# EAGLE design isense_rev1 (EAGLE 7.3.0)
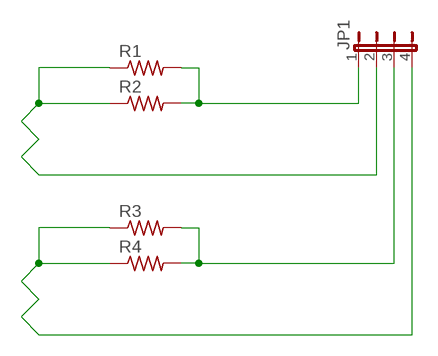
[diagram p0: schematic, sheet 1]

## Parts
JP1  JP4E  [JP4]
R1  R-US_R0603  [R0603]
R2  R-US_R0603  [R0603]
R3  R-US_R0603  [R0603]
R4  R-US_R0603  [R0603]

## Nets
COIL: JP1.2 R1.1 R2.1
COIL1: JP1.4 R3.1 R4.1
N$1: JP1.3 R3.2 R4.2
N$2: JP1.1 R1.2 R2.2

## Library data of the parts
JP1 = jumper:JP4E: JUMPER
R1-R4 = rcl:R-US_: RESISTOR, American symbol

## Board
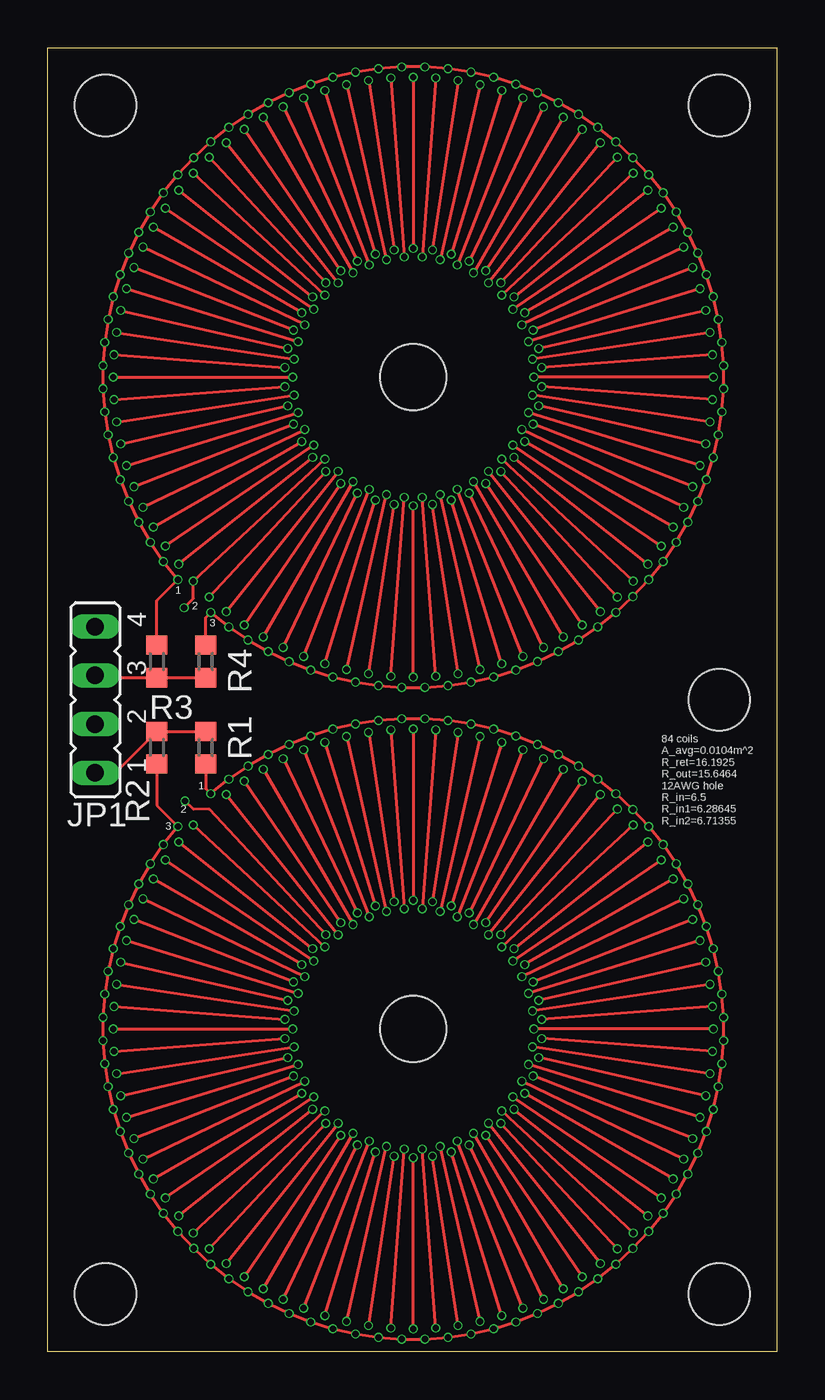
[diagram p1: board, top side]
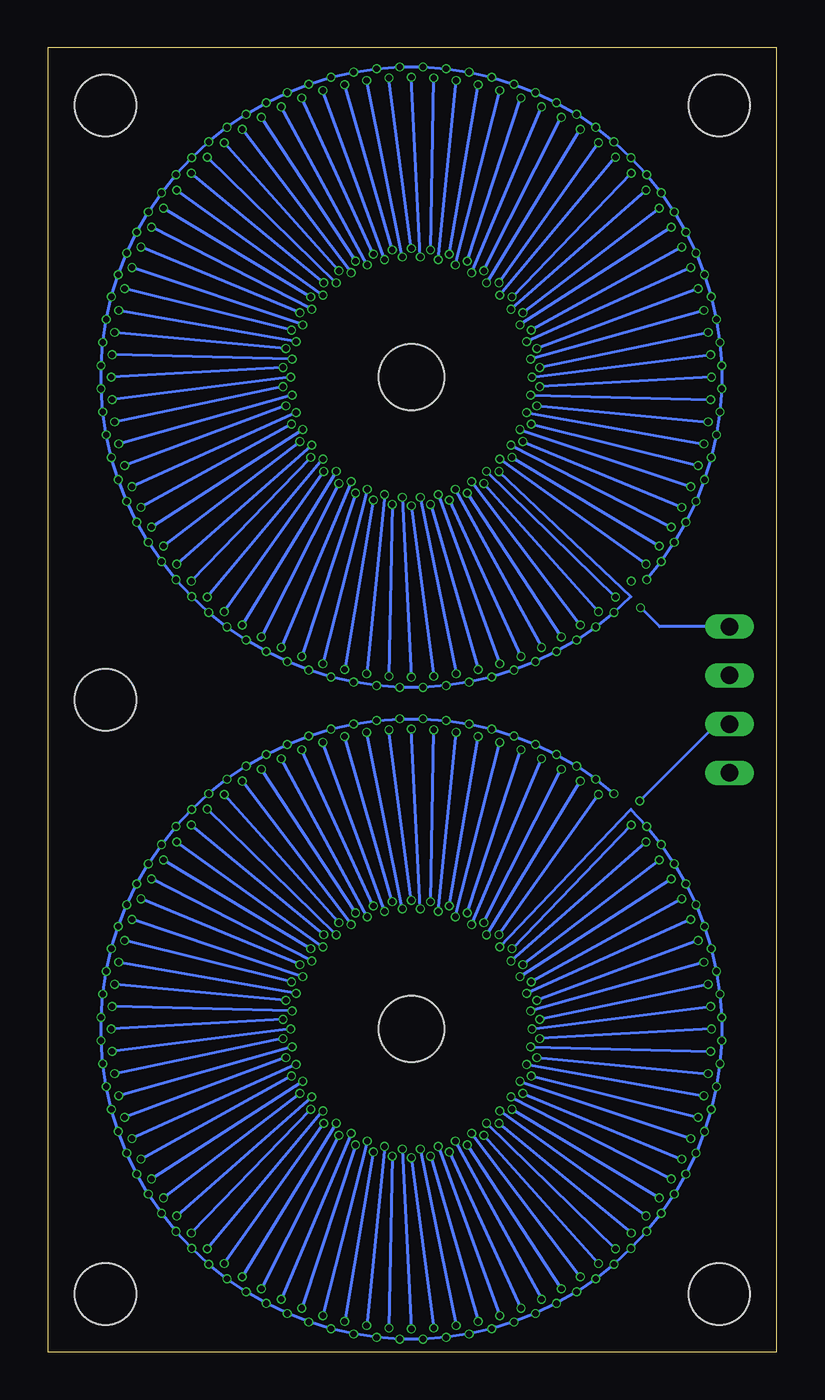
[diagram p2: board, bottom side, seen from below]

Size 38 x 68 mm. Coordinates in mm from the lower left corner, seen from the top.
Outline: 0,0 0,68 38,68 38,0 0,0
Copper layers (1*16): Top 0.035mm / dielectric 1.5mm / Bottom 0.035mm
Design rules "default *": minimum track width 6mil, minimum drill 0.33mm, track to track 6mil, track to pad 6mil, pad to pad 6mil, via to via 6mil, smd to smd 6mil, copper to edge 25mil, drill to drill 8mil, minimum pad ring 0mil, minimum via ring 0mil, stop-mask expansion 4mil, vias tented up to drill 20mil, thermal gap 10mil
Holes 3.43 mm at 19.05,16.83 19.05,50.83
Holes 3.2 mm at 3,3 35,34 3,65 35,65 35,3

### Footprints (pad centres in the part's own frame; a part is rotated, then mirrored left to right if it is on the bottom)
JP4 = drill 0.914 long: 1 -3.81,0; 2 -1.27,0; 3 1.27,0; 4 3.81,0
R0603 = smd 1 x 1.1: 1 -0.85,0; 2 0.85,0

### Placement (x,y rotation side)
JP1  2.46,34 90 top
R1  8.22,31.5 90 top
R2  5.68,31.5 90 top
R3  5.68,36 270 top
R4  8.22,36 270 top

### Tracks (layer width: path | path; a pad name or v marks a point on that pad's centre or on a via)
COIL  (via drill 0.33)
  Top 0.152: v14.48,21.75 8.41,28.3 7.6,28.28 v7.14,28.72 | v9.29,29.06 v15.13,21.74 | v10.24,29.75 v15.27,22.37 | v11.23,30.38 v15.91,22.27 | v12.26,30.92 v16.14,22.88 | v13.33,31.39 v16.75,22.68 | v14.44,31.78 v17.07,23.24 | v15.57,32.08 v17.65,22.96 | v16.72,32.3 v18.05,23.47 | v17.88,32.43 v18.58,23.1 | v7.58,27.47 v14.44,21.1 | v13.8,21.01 v6.82,26.58 | v13.86,20.37 v6.12,25.64 | v13.24,20.18 v5.5,24.65 | v13.39,19.55 v4.95,23.62 | v12.8,19.28 v4.49,22.54 | v4.1,21.44 v13.04,18.68 | v3.8,20.31 v12.51,18.32 | v3.58,19.16 v12.83,17.76 | v3.45,18 v12.36,17.33 | v3.4,16.83 v12.76,16.83 | v3.45,15.66 v12.36,16.33 | v19.05,32.47 v19.05,23.54 | v20.22,32.43 v19.52,23.1 | v21.38,32.3 v20.05,23.47 | v22.53,32.08 v20.45,22.96 | v23.66,31.78 v21.03,23.24 | v24.77,31.39 v21.35,22.68 | v25.84,30.92 v21.96,22.88 | v26.87,30.38 v22.19,22.27 | v27.86,29.75 v22.83,22.37 | v28.8,29.06 v22.97,21.74 | v29.69,28.3 v23.62,21.75 | v30.52,27.47 v23.66,21.1 | v31.28,26.58 v24.3,21.01 | v31.98,25.64 v24.24,20.37 | v32.6,24.65 v24.86,20.18 | v33.15,23.62 v24.71,19.55 | v33.62,22.54 v25.3,19.28 | v34,21.44 v25.06,18.68 | v34.3,20.31 v25.59,18.32 | v34.52,19.16 v25.27,17.76 | v34.65,18 v25.75,17.33 | v34.7,16.83 v25.34,16.83 | v34.65,15.66 v25.75,16.33 | v34.52,14.5 v25.27,15.89 | v34.3,13.35 v25.59,15.33 | v34,12.22 v25.06,14.97 | v33.62,11.11 v25.3,14.38 | v33.15,10.04 v24.71,14.1 | v32.6,9 v24.86,13.47 | v31.98,8.01 v24.24,13.29 | v31.28,7.07 v24.3,12.64 | v30.52,6.18 v23.66,12.55 | v29.69,5.36 v23.62,11.91 | v28.8,4.59 v22.97,11.91 | v27.86,3.9 v22.83,11.28 | v26.87,3.28 v22.19,11.38 | v25.84,2.73 v21.96,10.78 | v24.77,2.26 v21.35,10.98 | v23.66,1.88 v21.03,10.41 | v22.53,1.57 v20.45,10.7
  Top 0.152: v21.38,1.36 v20.05,10.19 | v20.22,1.23 v19.52,10.56 | v19.05,1.18 v19.05,10.11 | v17.88,1.23 v18.58,10.56 | v16.72,1.36 v18.05,10.19 | v15.57,1.57 v17.65,10.7 | v14.44,1.88 v17.07,10.41 | v13.33,2.26 v16.75,10.98 | v12.26,2.73 v16.14,10.78 | v11.23,3.28 v15.91,11.38 | v10.24,3.9 v15.27,11.28 | v9.29,4.59 v15.13,11.91 | v8.41,5.36 v14.48,11.91 | v7.58,6.18 v14.44,12.55 | v6.82,7.07 v13.8,12.64 | v6.12,8.01 v13.86,13.29 | v5.5,9 v13.24,13.47 | v4.95,10.04 v13.39,14.1 | v4.49,11.11 v12.8,14.38 | v4.1,12.22 v13.04,14.97 | v3.8,13.35 v12.51,15.33 | v3.58,14.5 v12.83,15.89 | R2.1 5.68,28.49 v6.78,27.39 v6.02,26.44 v5.34,25.44 v4.73,24.39 v4.21,23.3 v3.77,22.18 v3.41,21.02 v3.14,19.84 v2.96,18.64 v2.87,17.43 v2.87,16.22 v2.96,15.02 v3.14,13.82 v3.41,12.64 v3.77,11.48 v4.21,10.35 v4.73,9.26 v5.34,8.21 v6.02,7.21 v6.78,6.26 v7.6,5.38 v8.49,4.55 v9.44,3.8 v10.44,3.12 v11.48,2.51 v12.57,1.99 v13.7,1.54 v14.86,1.19 v16.04,0.92 v17.24,0.74 v18.45,0.65 v19.66,0.65 v20.86,0.74 v22.06,0.92 v23.24,1.19 v24.4,1.54 v25.52,1.99 v26.62,2.51 v27.66,3.12 v28.66,3.8 v29.61,4.55 v30.5,5.38 v31.32,6.26 v32.08,7.21 v32.76,8.21 v33.37,9.26 v33.89,10.35 v34.33,11.48 v34.69,12.64 v34.96,13.82 v35.14,15.02 v35.23,16.22 v35.23,17.43 v35.14,18.64 v34.96,19.84 v34.69,21.02 v34.33,22.18 v33.89,23.3 v33.37,24.39 v32.76,25.44 v32.08,26.44 v31.32,27.39 v30.5,28.28 v29.61,29.1 v28.66,29.86 v27.66,30.54 v26.62,31.14 v25.52,31.67 v24.4,32.11 v23.24,32.47 v22.06,32.74 v20.86,32.92 v19.66,33.01 v18.45,33.01 v17.24,32.92 v16.04,32.74 v14.86,32.47 v13.7,32.11 v12.57,31.67 v11.48,31.14 v10.44,30.54 v9.44,29.86 v8.49,29.1 8.22,29.37 R1.1
  Bottom 0.152: v14.48,21.75 v9.29,29.06 | v15.13,21.74 v10.24,29.75 | v15.27,22.37 v11.23,30.38 | v15.91,22.27 v12.26,30.92 | v16.14,22.88 v13.33,31.39 | v16.75,22.68 v14.44,31.78 | v17.07,23.24 v15.57,32.08 | v17.65,22.96 v16.72,32.3 | v18.05,23.47 v17.88,32.43 | v18.58,23.1 v19.05,32.47 | v14.44,21.1 7.6,28.28 v6.78,27.39 v6.02,26.44 v5.34,25.44 v4.73,24.39 v4.21,23.3 v3.77,22.18 v3.41,21.02 v3.14,19.84 v2.96,18.64 v2.87,17.43 v2.87,16.22 v2.96,15.02 v3.14,13.82 v3.41,12.64 v3.77,11.48 v4.21,10.35 v4.73,9.26 v5.34,8.21 v6.02,7.21 v6.78,6.26 v7.6,5.38 v8.49,4.55 v9.44,3.8 v10.44,3.12 v11.48,2.51 v12.57,1.99 v13.7,1.54 v14.86,1.19 v16.04,0.92 v17.24,0.74 v18.45,0.65 v19.66,0.65 v20.86,0.74 v22.06,0.92 v23.24,1.19 v24.4,1.54 v25.52,1.99 v26.62,2.51 v27.66,3.12 v28.66,3.8 v29.61,4.55 v30.5,5.38 v31.32,6.26 v32.08,7.21 v32.76,8.21 v33.37,9.26 v33.89,10.35 v34.33,11.48 v34.69,12.64 v34.96,13.82 v35.14,15.02 v35.23,16.22 v35.23,17.43 v35.14,18.64 v34.96,19.84 v34.69,21.02 v34.33,22.18 v33.89,23.3 v33.37,24.39 v32.76,25.44 v32.08,26.44 v31.32,27.39 v30.5,28.28 v29.61,29.1 v28.66,29.86 v27.66,30.54 v26.62,31.14 v25.52,31.67 v24.4,32.11 v23.24,32.47 v22.06,32.74 v20.86,32.92 v19.66,33.01 v18.45,33.01 v17.24,32.92 v16.04,32.74 v14.86,32.47 v13.7,32.11 v12.57,31.67 v11.48,31.14 v10.44,30.54 v9.44,29.86 v8.49,29.1 | v7.58,27.47 v13.8,21.01 | v6.82,26.58 v13.86,20.37 | v6.12,25.64 v13.24,20.18 | v5.5,24.65 v13.39,19.55 | v4.95,23.62 v12.8,19.28 | v4.49,22.54 v13.04,18.68 | v4.1,21.44 v12.51,18.32 | v3.8,20.31 v12.83,17.76 | v3.58,19.16 v12.36,17.33 | v12.76,16.83 v3.45,18
  Bottom 0.152: v3.4,16.83 v12.36,16.33 | v19.05,23.54 v20.22,32.43 | v19.52,23.1 v21.38,32.3 | v20.05,23.47 v22.53,32.08 | v20.45,22.96 v23.66,31.78 | v21.03,23.24 v24.77,31.39 | v21.35,22.68 v25.84,30.92 | v21.96,22.88 v26.87,30.38 | v22.19,22.27 v27.86,29.75 | v22.83,22.37 v28.8,29.06 | v22.97,21.74 v29.69,28.3 | v23.62,21.75 v30.52,27.47 | v23.66,21.1 v31.28,26.58 | v24.3,21.01 v31.98,25.64 | v24.24,20.37 v32.6,24.65 | v24.86,20.18 v33.15,23.62 | v24.71,19.55 v33.62,22.54 | v25.3,19.28 v34,21.44 | v25.06,18.68 v34.3,20.31 | v25.59,18.32 v34.52,19.16 | v25.27,17.76 v34.65,18 | v25.75,17.33 v34.7,16.83 | v25.34,16.83 v34.65,15.66 | v25.75,16.33 v34.52,14.5 | v25.27,15.89 v34.3,13.35 | v25.59,15.33 v34,12.22 | v25.06,14.97 v33.62,11.11 | v25.3,14.38 v33.15,10.04 | v24.71,14.1 v32.6,9 | v24.86,13.47 v31.98,8.01 | v24.24,13.29 v31.28,7.07 | v24.3,12.64 v30.52,6.18 | v23.66,12.55 v29.69,5.36 | v23.62,11.91 v28.8,4.59 | v22.97,11.91 v27.86,3.9 | v22.83,11.28 v26.87,3.28 | v22.19,11.38 v25.84,2.73 | v21.96,10.78 v24.77,2.26 | v21.35,10.98 v23.66,1.88 | v21.03,10.41 v22.53,1.57 | v20.45,10.7 v21.38,1.36 | v20.05,10.19 v20.22,1.23 | v19.52,10.56 v19.05,1.18 | v19.05,10.11 v17.88,1.23 | v18.58,10.56 v16.72,1.36 | v18.05,10.19 v15.57,1.57 | v17.65,10.7 v14.44,1.88 | v17.07,10.41 v13.33,2.26 | v16.75,10.98 v12.26,2.73 | v16.14,10.78 v11.23,3.28 | v15.91,11.38 v10.24,3.9 | v15.27,11.28 v9.29,4.59 | v15.13,11.91 v8.41,5.36 | v14.48,11.91 v7.58,6.18 | v14.44,12.55 v6.82,7.07 | v13.8,12.64 v6.12,8.01 | v13.86,13.29 v5.5,9 | v13.24,13.47 v4.95,10.04 | v13.39,14.1 v4.49,11.11 | v12.8,14.38 v4.1,12.22 | v13.04,14.97 v3.8,13.35 | v12.51,15.33 v3.58,14.5 | v12.83,15.89 v3.45,15.66 | JP1.2 3.14,32.73 v7.14,28.72
COIL1  (via drill 0.33)
  Top 0.152: v8.41,62.3 v14.48,55.75 | v9.29,63.06 v15.13,55.74 | v10.24,63.76 v15.27,56.37 | v11.23,64.38 v15.91,56.27 | v12.26,64.92 v16.14,56.88 | v13.33,65.39 v16.75,56.68 | v14.44,65.78 v17.07,57.24 | v15.57,66.08 v17.65,56.96 | v16.72,66.3 v18.05,57.47 | v17.88,66.43 v18.58,57.1 | v13.8,55.01 v6.82,60.58 | v13.86,54.37 v6.12,59.64 | v13.24,54.18 v5.5,58.65 | v13.39,53.55 v4.95,57.62 | v12.8,53.28 v4.49,56.54 | v4.1,55.44 v13.04,52.68 | v3.8,54.31 v12.51,52.32 | v3.58,53.16 v12.83,51.76 | v3.45,52 v12.36,51.33 | v3.4,50.83 v12.76,50.83 | v3.45,49.66 v12.36,50.33 | v19.05,66.47 v19.05,57.54 | v20.22,66.43 v19.52,57.1 | v21.38,66.3 v20.05,57.47 | v22.53,66.08 v20.45,56.96 | v23.66,65.78 v21.03,57.24 | v24.77,65.39 v21.35,56.68 | v25.84,64.92 v21.96,56.88 | v26.87,64.38 v22.19,56.27 | v27.86,63.76 v22.83,56.37 | v28.8,63.06 v22.97,55.74 | v29.69,62.3 v23.62,55.75 | v30.52,61.47 v23.66,55.1 | v31.28,60.58 v24.3,55.01 | v31.98,59.64 v24.24,54.37 | v32.6,58.65 v24.86,54.18 | v33.15,57.62 v24.71,53.55 | v33.62,56.54 v25.3,53.28 | v34,55.44 v25.06,52.68 | v34.3,54.31 v25.59,52.32 | v34.52,53.16 v25.27,51.76 | v34.65,52 v25.75,51.33 | v34.7,50.83 v25.34,50.83 | v34.65,49.66 v25.75,50.33 | v34.52,48.5 v25.27,49.89 | v34.3,47.35 v25.59,49.33 | v34,46.22 v25.06,48.98 | v33.62,45.11 v25.3,48.38 | v33.15,44.04 v24.71,48.1 | v32.6,43 v24.86,47.47 | v31.98,42.01 v24.24,47.29 | v31.28,41.07 v24.3,46.64 | v30.52,40.19 v23.66,46.55 | v29.69,39.36 v23.62,45.91 | v28.8,38.59 v22.97,45.91 | v27.86,37.9 v22.83,45.28 | v26.87,37.28 v22.19,45.38 | v25.84,36.73 v21.96,44.78 | v24.77,36.26 v21.35,44.98 | v23.66,35.88 v21.03,44.41 | v22.53,35.57 v20.45,44.7 | v21.38,35.36 v20.05,44.19 | v20.22,35.23 v19.52,44.56
  Top 0.152: v19.05,35.18 v19.05,44.11 | v17.88,35.23 v18.58,44.56 | v16.72,35.36 v18.05,44.19 | v15.57,35.57 v17.65,44.7 | v14.44,35.88 v17.07,44.41 | v13.33,36.26 v16.75,44.98 | v12.26,36.73 v16.14,44.78 | v11.23,37.28 v15.91,45.38 | v10.24,37.9 v15.27,45.28 | v9.29,38.59 v15.13,45.91 | v8.41,39.36 v14.48,45.91 | v6.82,41.07 v13.8,46.64 | v6.12,42.01 v13.86,47.29 | v5.5,43 v13.24,47.47 | v4.95,44.04 v13.39,48.1 | v4.49,45.11 v12.8,48.38 | v4.1,46.22 v13.04,48.98 | v3.8,47.35 v12.51,49.33 | v3.58,48.5 v12.83,49.89 | v14.44,55.1 v7.58,61.47 | v14.44,46.55 v7.58,40.19 7.58,39.28 v7.1,38.8 | R3.1 5.68,39.17 v6.78,40.27 v6.02,41.21 v5.34,42.21 v4.73,43.26 v4.21,44.35 v3.77,45.48 v3.41,46.64 v3.14,47.82 v2.96,49.02 v2.87,50.22 v2.87,51.43 v2.96,52.64 v3.14,53.84 v3.41,55.02 v3.77,56.18 v4.21,57.3 v4.73,58.39 v5.34,59.44 v6.02,60.44 v6.78,61.39 v7.6,62.28 v8.49,63.1 v9.44,63.86 v10.44,64.54 v11.48,65.14 v12.57,65.67 v13.7,66.11 v14.86,66.47 v16.04,66.74 v17.24,66.92 v18.45,67.01 v19.66,67.01 v20.86,66.92 v22.06,66.74 v23.24,66.47 v24.4,66.11 v25.52,65.67 v26.62,65.14 v27.66,64.54 v28.66,63.86 v29.61,63.1 v30.5,62.28 v31.32,61.39 v32.08,60.44 v32.76,59.44 v33.37,58.39 v33.89,57.3 v34.33,56.18 v34.69,55.02 v34.96,53.84 v35.14,52.64 v35.23,51.43 v35.23,50.22 v35.14,49.02 v34.96,47.82 v34.69,46.64 v34.33,45.48 v33.89,44.35 v33.37,43.26 v32.76,42.21 v32.08,41.21 v31.32,40.27 v30.5,39.38 v29.61,38.55 v28.66,37.8 v27.66,37.12 v26.62,36.51 v25.52,35.99 v24.4,35.54 v23.24,35.19 v22.06,34.92 v20.86,34.74 v19.66,34.65 v18.45,34.65 v17.24,34.74 v16.04,34.92 v14.86,35.19 v13.7,35.54 v12.57,35.99 v11.48,36.51 v10.44,37.12 v9.44,37.8 v8.49,38.55 8.22,38.29 R4.1
  Bottom 0.152: v14.48,55.75 v9.29,63.06 | v15.13,55.74 v10.24,63.76 | v15.27,56.37 v11.23,64.38 | v15.91,56.27 v12.26,64.92 | v16.14,56.88 v13.33,65.39 | v16.75,56.68 v14.44,65.78 | v17.07,57.24 v15.57,66.08 | v17.65,56.96 v16.72,66.3 | v18.05,57.47 v17.88,66.43 | v18.58,57.1 v19.05,66.47 | v7.58,61.47 v13.8,55.01 | v6.82,60.58 v13.86,54.37 | v6.12,59.64 v13.24,54.18 | v5.5,58.65 v13.39,53.55 | v4.95,57.62 v12.8,53.28 | v4.49,56.54 v13.04,52.68 | v4.1,55.44 v12.51,52.32 | v3.8,54.31 v12.83,51.76 | v3.58,53.16 v12.36,51.33 | v12.76,50.83 v3.45,52 | v3.4,50.83 v12.36,50.33 | v19.05,57.54 v20.22,66.43 | v19.52,57.1 v21.38,66.3 | v20.05,57.47 v22.53,66.08 | v20.45,56.96 v23.66,65.78 | v21.03,57.24 v24.77,65.39 | v21.35,56.68 v25.84,64.92 | v21.96,56.88 v26.87,64.38 | v22.19,56.27 v27.86,63.76 | v22.83,56.37 v28.8,63.06 | v22.97,55.74 v29.69,62.3 | v23.62,55.75 v30.52,61.47 | v23.66,55.1 v31.28,60.58 | v24.3,55.01 v31.98,59.64 | v24.24,54.37 v32.6,58.65 | v24.86,54.18 v33.15,57.62 | v24.71,53.55 v33.62,56.54 | v25.3,53.28 v34,55.44 | v25.06,52.68 v34.3,54.31 | v25.59,52.32 v34.52,53.16 | v25.27,51.76 v34.65,52 | v25.75,51.33 v34.7,50.83 | v25.34,50.83 v34.65,49.66 | v25.75,50.33 v34.52,48.5 | v25.27,49.89 v34.3,47.35 | v25.59,49.33 v34,46.22 | v25.06,48.98 v33.62,45.11 | v25.3,48.38 v33.15,44.04 | v24.71,48.1 v32.6,43 | v24.86,47.47 v31.98,42.01 | v24.24,47.29 v31.28,41.07 | v24.3,46.64 v30.52,40.19 | v23.66,46.55 v29.69,39.36 | v23.62,45.91 v28.8,38.59 | v22.97,45.91 v27.86,37.9 | v22.83,45.28 v26.87,37.28 | v22.19,45.38 v25.84,36.73 | v21.96,44.78 v24.77,36.26 | v21.35,44.98 v23.66,35.88 | v21.03,44.41 v22.53,35.57 | v20.45,44.7 v21.38,35.36 | v20.05,44.19 v20.22,35.23 | v19.52,44.56 v19.05,35.18
  Bottom 0.152: v19.05,44.11 v17.88,35.23 | v18.58,44.56 v16.72,35.36 | v18.05,44.19 v15.57,35.57 | v17.65,44.7 v14.44,35.88 | v17.07,44.41 v13.33,36.26 | v16.75,44.98 v12.26,36.73 | v16.14,44.78 v11.23,37.28 | v15.91,45.38 v10.24,37.9 | v15.27,45.28 v9.29,38.59 | v15.13,45.91 v8.41,39.36 | v14.44,46.55 v6.82,41.07 | v13.8,46.64 v6.12,42.01 | v13.86,47.29 v5.5,43 | v13.24,47.47 v4.95,44.04 | v13.39,48.1 v4.49,45.11 | v12.8,48.38 v4.1,46.22 | v13.04,48.98 v3.8,47.35 | v12.51,49.33 v3.58,48.5 | v12.83,49.89 v3.45,49.66 | v6.78,40.27 v6.02,41.21 v5.34,42.21 v4.73,43.26 v4.21,44.35 v3.77,45.48 v3.41,46.64 v3.14,47.82 v2.96,49.02 v2.87,50.22 v2.87,51.43 v2.96,52.64 v3.14,53.84 v3.41,55.02 v3.77,56.18 v4.21,57.3 v4.73,58.39 v5.34,59.44 v6.02,60.44 v6.78,61.39 v7.6,62.28 v8.49,63.1 v9.44,63.86 v10.44,64.54 v11.48,65.14 v12.57,65.67 v13.7,66.11 v14.86,66.47 v16.04,66.74 v17.24,66.92 v18.45,67.01 v19.66,67.01 v20.86,66.92 v22.06,66.74 v23.24,66.47 v24.4,66.11 v25.52,65.67 v26.62,65.14 v27.66,64.54 v28.66,63.86 v29.61,63.1 v30.5,62.28 v31.32,61.39 v32.08,60.44 v32.76,59.44 v33.37,58.39 v33.89,57.3 v34.33,56.18 v34.69,55.02 v34.96,53.84 v35.14,52.64 v35.23,51.43 v35.23,50.22 v35.14,49.02 v34.96,47.82 v34.69,46.64 v34.33,45.48 v33.89,44.35 v33.37,43.26 v32.76,42.21 v32.08,41.21 v31.32,40.27 v30.5,39.38 v29.61,38.55 v28.66,37.8 v27.66,37.12 v26.62,36.51 v25.52,35.99 v24.4,35.54 v23.24,35.19 v22.06,34.92 v20.86,34.74 v19.66,34.65 v18.45,34.65 v17.24,34.74 v16.04,34.92 v14.86,35.19 v13.7,35.54 v12.57,35.99 v11.48,36.51 v10.44,37.12 v9.44,37.8 v8.49,38.55 7.6,39.38 v14.48,45.91
  Bottom 0.152: v8.41,62.3 v14.44,55.1 | JP1.4 6.11,37.81 v7.1,38.8
N$1
  Top 0.152: JP1.3 2.58,35.15 R3.2 R4.2
N$2
  Top 0.152: R1.2 R2.2 3.52,30.19 JP1.1

### Text on the board
tPlace: 1 | 2 | 3 | 1 | 2 | 3 | 84 coils / A_avg=0.0104m^2 / R_ret=16.1925 / R_out=15.6464 / 12AWG hole / R_in=6.5 / R_in1=6.28645 / R_in2=6.71355